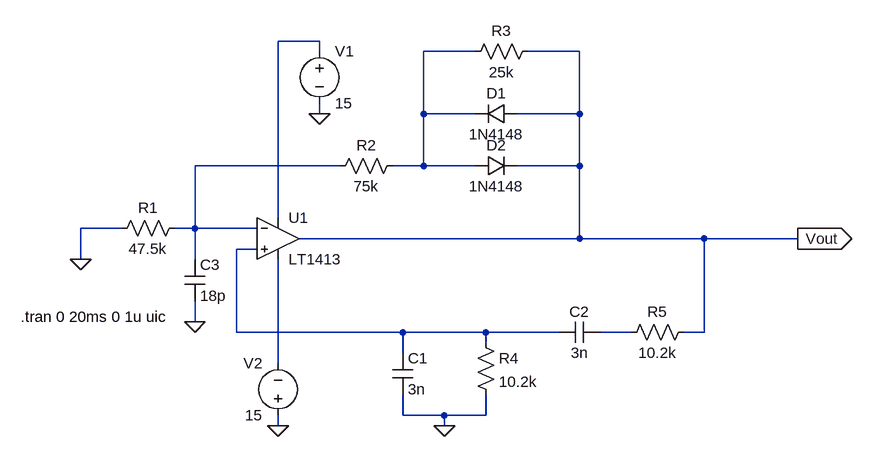
[diagram p0: schematic Wein_Bridge_OSC.asc]
Wein_Bridge_OSC.asc, the LTspice schematic file:
Version 4
SHEET 1 1120 680
WIRE 272 -192 208 -192
WIRE 272 -176 272 -192
WIRE 512 -176 432 -176
WIRE 672 -176 592 -176
WIRE 272 -80 272 -96
WIRE 432 -80 432 -176
WIRE 512 -80 432 -80
WIRE 672 -80 672 -176
WIRE 672 -80 576 -80
WIRE 304 0 80 0
WIRE 432 0 432 -80
WIRE 432 0 384 0
WIRE 512 0 432 0
WIRE 672 0 672 -80
WIRE 672 0 576 0
WIRE 208 80 208 -192
WIRE -32 96 -96 96
WIRE 80 96 80 0
WIRE 80 96 48 96
WIRE 176 96 80 96
WIRE 672 112 672 0
WIRE 672 112 240 112
WIRE 864 112 672 112
WIRE 1008 112 864 112
WIRE 176 128 144 128
WIRE -96 144 -96 96
WIRE 80 144 80 96
WIRE 80 240 80 208
WIRE 144 256 144 128
WIRE 400 256 144 256
WIRE 528 256 400 256
WIRE 640 256 528 256
WIRE 752 256 704 256
WIRE 864 256 864 112
WIRE 864 256 832 256
WIRE 528 272 528 256
WIRE 400 288 400 256
WIRE 208 304 208 144
WIRE 400 384 400 352
WIRE 464 384 400 384
WIRE 528 384 528 352
WIRE 528 384 464 384
WIRE 208 400 208 384
WIRE 464 400 464 384
FLAG -96 144 0
FLAG 464 400 0
FLAG 1008 112 Vout
IOPIN 1008 112 Out
FLAG 208 400 0
FLAG 272 -80 0
FLAG 80 240 0
SYMBOL OpAmps\\LT1413 208 48 R0
SYMATTR InstName U1
SYMBOL res 64 80 R90
WINDOW 0 0 56 VBottom 2
WINDOW 3 32 56 VTop 2
SYMATTR InstName R1
SYMATTR Value 47.5k
SYMBOL res 400 -16 R90
WINDOW 0 0 56 VBottom 2
WINDOW 3 32 56 VTop 2
SYMATTR InstName R2
SYMATTR Value 75k
SYMBOL res 608 -192 R90
WINDOW 0 0 56 VBottom 2
WINDOW 3 32 56 VTop 2
SYMATTR InstName R3
SYMATTR Value 25k
SYMBOL diode 576 -96 R90
WINDOW 0 0 32 VBottom 2
WINDOW 3 32 32 VTop 2
SYMATTR InstName D1
SYMATTR Value 1N4148
SYMBOL diode 512 16 R270
WINDOW 0 32 32 VTop 2
WINDOW 3 0 32 VBottom 2
SYMATTR InstName D2
SYMATTR Value 1N4148
SYMBOL cap 384 288 R0
SYMATTR InstName C1
SYMATTR Value 3n
SYMBOL res 512 256 R0
SYMATTR InstName R4
SYMATTR Value 10.2k
SYMBOL res 848 240 R90
WINDOW 0 0 56 VBottom 2
WINDOW 3 32 56 VTop 2
SYMATTR InstName R5
SYMATTR Value 10.2k
SYMBOL cap 704 240 R90
WINDOW 0 0 32 VBottom 2
WINDOW 3 32 32 VTop 2
SYMATTR InstName C2
SYMATTR Value 3n
SYMBOL voltage 272 -192 R0
WINDOW 123 0 0 Left 0
WINDOW 39 0 0 Left 0
SYMATTR InstName V1
SYMATTR Value 15
SYMBOL voltage 208 400 R180
WINDOW 0 24 96 Left 2
WINDOW 3 24 16 Left 2
WINDOW 123 0 0 Left 0
WINDOW 39 0 0 Left 0
SYMATTR InstName V2
SYMATTR Value 15
SYMBOL cap 64 144 R0
SYMATTR InstName C3
SYMATTR Value 18p
TEXT -188 232 Left 2 !.tran 0 20ms 0 1u uic

The netlist it stands for:
* Wein_Bridge_OSC.asc
XU1 N004 N003 N001 N006 Vout LT1413  ; pins In+ In- V+ V- OUT
R1 N003 0 47.5k
R2 N002 N003 75k
R3 Vout N002 25k
D1 Vout N002 1N4148
D2 N002 Vout 1N4148
C1 N004 0 3n
R4 N004 0 10.2k
R5 Vout N005 10.2k
C2 N005 N004 3n
V1 N001 0 15
V2 0 N006 15
C3 N003 0 18p
.model D D
.lib standard.dio
.tran 0 20ms 0 1u uic
.lib LTC.lib
.backanno
.end